# Altium project NUCLEOG431RB-Custom-IN-A2212.PrjPcb (part 4 of 4)

## Sheet Connector.SchDoc
size A3
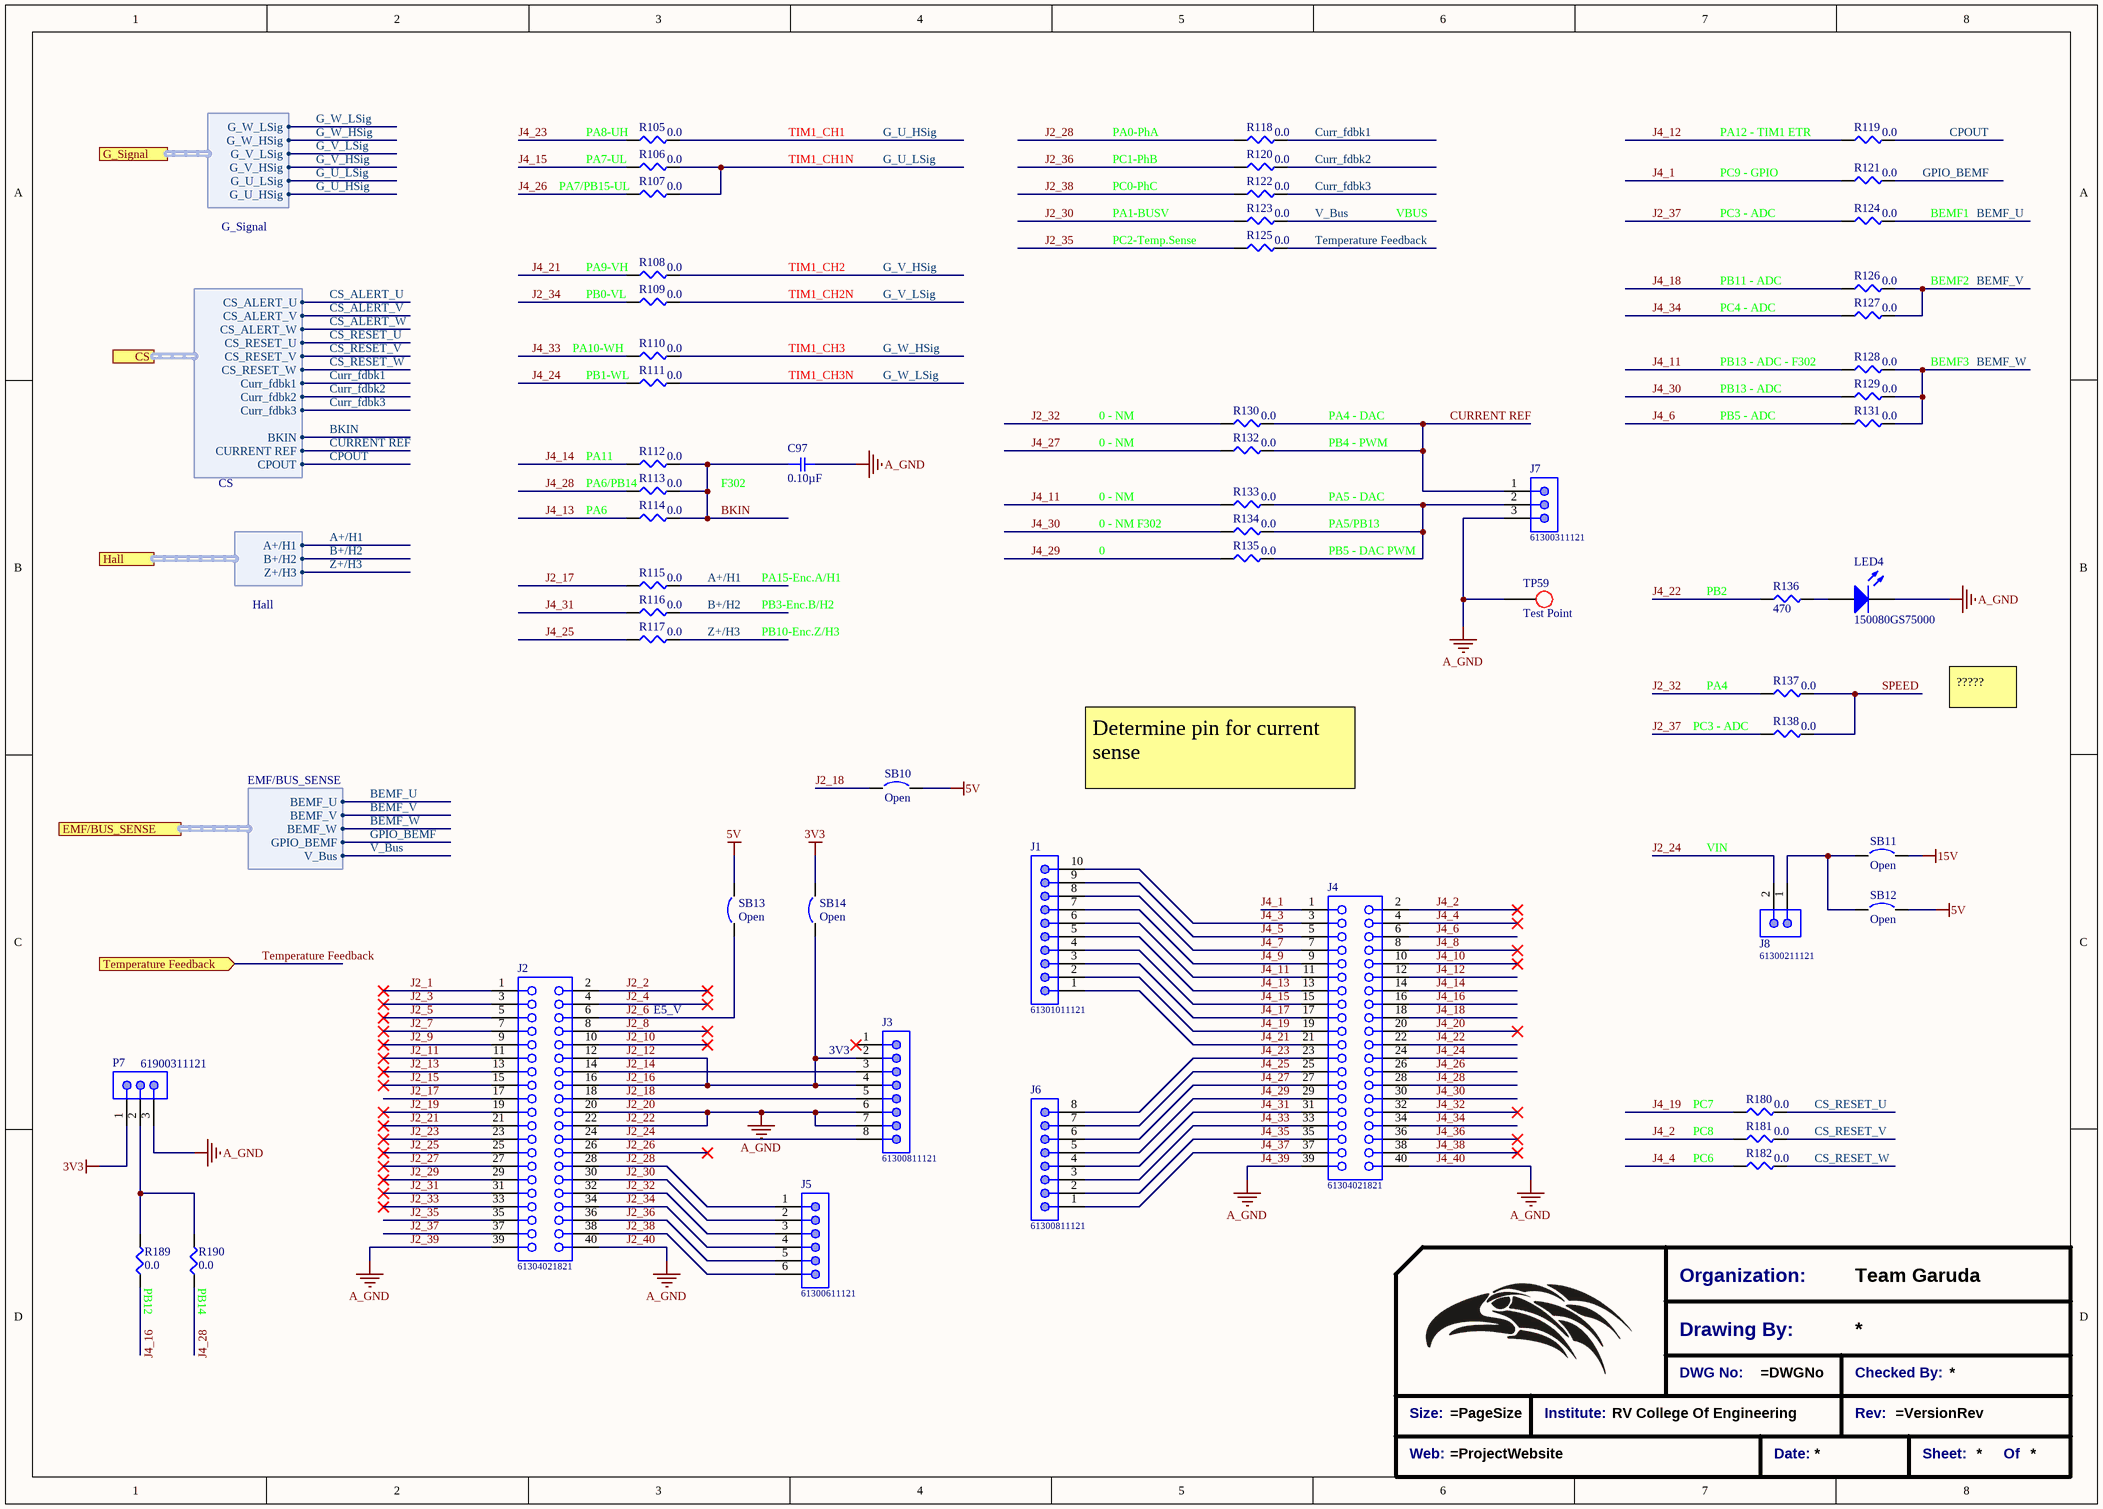
[diagram p9: Connector.SchDoc]

### Parts
(Parts that share a designator on the sheet are numbered #1, #2 ... from top to bottom, then left to right.)
*?#7  Title_Block  (value not drawn)  (graphical)
C97  0.10µF  [SMD-0805C]
J1  61301011121  [61301011121]
J2  61304021821  [61304021821]
J3  61300811121  [61300811121]
J4  61304021821  [61304021821]
J5  61300611121  [61300611121]
J6  61300811121  [61300811121]
J7  61300311121  [61300311121]
J8  61300211121  [61300211121]
LED4  150080GS75000  [0805_A]
P7  61900311121  [61900311121]
R105  0.0  [SMD-0603-RES]
R106  0.0  [SMD-0603-RES]
R107  0.0  [SMD-0603-RES]
R108  0.0  [SMD-0603-RES]
R109  0.0  [SMD-0603-RES]
R110  0.0  [SMD-0603-RES]
R111  0.0  [SMD-0603-RES]
R112  0.0  [SMD-0603-RES]
R113  0.0  [SMD-0603-RES]
R114  0.0  [SMD-0603-RES]
R115  0.0  [SMD-0603-RES]
R116  0.0  [SMD-0603-RES]
R117  0.0  [SMD-0603-RES]
R118  0.0  [SMD-0603-RES]
R119  0.0  [SMD-0603-RES]
R120  0.0  [SMD-0603-RES]
R121  0.0  [SMD-0603-RES]
R122  0.0  [SMD-0603-RES]
R123  0.0  [SMD-0603-RES]
R124  0.0  [SMD-0603-RES]
R125  0.0  [SMD-0603-RES]
R126  0.0  [SMD-0603-RES]
R127  0.0  [SMD-0603-RES]
R128  0.0  [SMD-0603-RES]
R129  0.0  [SMD-0603-RES]
R130  0.0  [SMD-0603-RES]
R131  0.0  [SMD-0603-RES]
R132  0.0  [SMD-0603-RES]
R133  0.0  [SMD-0603-RES]
R134  0.0  [SMD-0603-RES]
R135  0.0  [SMD-0603-RES]
R136  470  [SMD-0603-RES]
R137  0.0  [SMD-0603-RES]
R138  0.0  [SMD-0603-RES]
R180  0.0  [SMD-0603-RES]
R181  0.0  [SMD-0603-RES]
R182  0.0  [SMD-0603-RES]
R189  0.0  [SMD-0603-RES]
R190  0.0  [SMD-0603-RES]
SB10  Open  [Solder Bridge - HP]  (no BOM)
SB11  Open  [Solder Bridge - HP]  (no BOM)
SB12  Open  [Solder Bridge - HP]  (no BOM)
SB13  Open  [Solder Bridge - HP]  (no BOM)
SB14  Open  [0805-Solder Bridge]  (no BOM)
TP59  Test Point  [Test_point_THT]  (no BOM)

### Ports
CS (harness CS), EMF/BUS_SENSE (harness EMF/BUS_SENSE), G_Signal (harness G_Signal), Hall (harness Hall), Temperature Feedback (in)

### Harnesses
G_Signal: G_U_HSig, G_U_LSig, G_V_HSig, G_V_LSig, G_W_HSig, G_W_LSig
CS: CS_ALERT_U, CS_ALERT_V, CS_ALERT_W, CS_RESET_U, CS_RESET_V, CS_RESET_W, Curr_fdbk1, Curr_fdbk2, Curr_fdbk3, BKIN, CURRENT REF, CPOUT
Hall: A+/H1, B+/H2, Z+/H3
EMF/BUS_SENSE: BEMF_U, BEMF_V, BEMF_W, GPIO_BEMF, V_Bus

### Nets
3v3: P7.1 SB14.2
5V: SB10.2 SB12.2 SB13.2
15V: SB11.2
A_GND: C97.2 J2.20 J2.22 J2.39 J2.40 J3.6 J3.7 J4.39 J4.40 J7.3 LED4.1(K) P7.3 TP59.1  [also labelled J2_20, J2_22, J2_39, J2_40, J4_39, J4_40]
A+/H1: R115.2 ; port Hall.A+/H1
B+/H2: R116.2 ; port Hall.B+/H2
BEMF_U: R124.2 ; port EMF/BUS_SENSE.BEMF_U
BEMF_V: R126.2 R127.2 ; port EMF/BUS_SENSE.BEMF_V
BEMF_W: R128.2 R129.2 R131.2 ; port EMF/BUS_SENSE.BEMF_W
BKIN: C97.1 R112.2 R113.2 R114.2 ; port CS.BKIN
CPOUT: R119.2 ; port CS.CPOUT
CS_RESET_U: R180.2 ; port CS.CS_RESET_U
CS_RESET_V: R181.2 ; port CS.CS_RESET_V
CS_RESET_W: R182.2 ; port CS.CS_RESET_W
Curr_fdbk1: R118.2 ; port CS.Curr_fdbk1
Curr_fdbk2: R120.2 ; port CS.Curr_fdbk2
Curr_fdbk3: R122.2 ; port CS.Curr_fdbk3
CURRENT REF: J7.1 R130.2 R132.2 ; port CS.CURRENT REF
G_U_HSig: R105.2 ; port G_Signal.G_U_HSig
G_U_LSig: R106.2 R107.2 ; port G_Signal.G_U_LSig
G_V_HSig: R108.2 ; port G_Signal.G_V_HSig
G_V_LSig: R109.2 ; port G_Signal.G_V_LSig
G_W_HSig: R110.2 ; port G_Signal.G_W_HSig
G_W_LSig: R111.2 ; port G_Signal.G_W_LSig
GPIO_BEMF: R121.2 ; port EMF/BUS_SENSE.GPIO_BEMF
J2_1: J2.1
J2_2: J2.2
J2_3: J2.3
J2_4: J2.4
J2_5: J2.5
J2_6: J2.6 SB13.1
J2_7: J2.7
J2_8: J2.8
J2_9: J2.9
J2_10: J2.10
J2_11: J2.11
J2_12: J2.12 J2.16 J3.2 J3.4 SB14.1  [also labelled J2_16]
J2_13: J2.13
J2_14: J2.14 J3.3
J2_15: J2.15
J2_17: J2.17 R115.1
J2_18: J2.18 J3.5 SB10.1
J2_19: J2.19
J2_21: J2.21
J2_23: J2.23
J2_24: J2.24 J3.8 J8.2
J2_25: J2.25
J2_26: J2.26
J2_27: J2.27
J2_28: J2.28 J5.1 R118.1
J2_29: J2.29
J2_30: J2.30 J5.2 R123.1
J2_31: J2.31
J2_32: J2.32 J5.3 R130.1 R137.1
J2_33: J2.33
J2_34: J2.34 J5.4 R109.1
J2_35: J2.35 R125.1
J2_36: J2.36 J5.5 R120.1
J2_37: J2.37 R124.1 R138.1
J2_38: J2.38 J5.6 R122.1
J4_1: J4.1 R121.1
J4_2: J4.2 R181.1
J4_3: J1.10 J4.3
J4_4: J4.4 R182.1
J4_5: J1.9 J4.5
J4_6: J4.6 R131.1
J4_7: J1.8 J4.7
J4_8: J4.8
J4_9: J1.7 J4.9
J4_10: J4.10
J4_11: J1.6 J4.11 R128.1 R133.1
J4_12: J4.12 R119.1
J4_13: J1.5 J4.13 R114.1
J4_14: J4.14 R112.1
J4_15: J1.4 J4.15 R106.1
J4_16: J4.16 R189.1
J4_17: J1.3 J4.17
J4_18: J4.18 R126.1
J4_19: J1.2 J4.19 R180.1
J4_20: J4.20
J4_21: J1.1 J4.21 R108.1
J4_22: J4.22 R136.1
J4_23: J4.23 J6.8 R105.1
J4_24: J4.24 R111.1
J4_25: J4.25 J6.7 R117.1
J4_26: J4.26 R107.1
J4_27: J4.27 J6.6 R132.1
J4_28: J4.28 R113.1 R190.1
J4_29: J4.29 J6.5 R135.1
J4_30: J4.30 R129.1 R134.1
J4_31: J4.31 J6.4 R116.1
J4_32: J4.32
J4_33: J4.33 J6.3 R110.1
J4_34: J4.34 R127.1
J4_35: J4.35 J6.2
J4_36: J4.36
J4_37: J4.37 J6.1
J4_38: J4.38
SPEED: R137.2 R138.2
Temperature Feedback: R125.2 ; port Temperature Feedback
V_Bus: R123.2 ; port EMF/BUS_SENSE.V_Bus
Z+/H3: R117.2 ; port Hall.Z+/H3
NetJ7_2: J7.2 R133.2 R134.2 R135.2
NetJ8_1: J8.1 SB11.1 SB12.1
NetLED4_2: LED4.2(A) R136.2
NetP7_2: P7.2 R189.2 R190.2

Not connected (* = marked no-connect by the designer): J3 1*

### Notes on the sheet
- (near R105) PA8-UH
- PA7-UL
- TIM1_CH1
- TIM1_CH1N
- PA0-PhA
- PC1-PhB
- PA12 - TIM1 ETR
- PC9 - GPIO
- PA7/PB15-UL
- PC0-PhC
- PA1-BUSV
- PC2-Temp.Sense
- VBUS
- PC3 - ADC
- BEMF1
- (near R108) PA9-VH
- PB0-VL
- TIM1_CH2
- TIM1_CH2N
- PB11 - ADC
- PC4 - ADC
- BEMF2
- PA10-WH
- PB1-WL
- TIM1_CH3
- TIM1_CH3N
- PB13 - ADC - F302
- BEMF3
- 0 - NM
- PA4 - DAC
- PB4 - PWM
- PB13 - ADC
- PB5 - ADC
- PA11
- (near R113) PA6/PB14
- PA6
- F302
- PA5 - DAC
- PA15-Enc.A/H1
- 0 - NM F302
- 0
- PA5/PB13
- PB5 - DAC PWM
- PB3-Enc.B/H2
- PB10-Enc.Z/H3
- (near R136) PB2
- PA4
- ?????
- Determine pin for current sense
- VIN
- E5_V
- (near J3) 3V3
- PC7
- PC8
- PC6
- (near R189) PB12
- (near R190) PB14
- (in symbol Title_Block) Organization:; Team Garuda; Drawing By:; DWG No:; Checked By:; Size:; Institute:; RV College Of Engineering; Rev:; Web:; Date:; Sheet:; Of

### Library data of the parts
*?#7 = Title_Block: Standard Title Block
C97 = GCD21BR71H104KA01L: CAP CER 0.1UF 50V X7R 0805; Manufacturer: Murata Electronics North America; Factory Stock: 0; Unit Price (USD): 0.24; Minimum Quantity: 1; Tolerance: ±10%; Datasheets: http://www.murata.com/~/media/webrenewal/support/library/catalog/products/capacitor/mlcc/c03e.ashx; Image: //media.digikey.com/Renders/Murata%20Renders/0805%28GxM6%29.jpg; Digi-Key Part Number: 490-11955-1-ND; Part Number: GCD21BR71H104KA01L; Quantity Available: 157; @ qty: 0; Packaging: Cut Tape (CT); Series: GCD; Part Status: Active; Value: 0.10µF; Voltage: 50V; Temperature Coefficient: X7R; Operating Temperature: -55°C ~ 125°C; Features: -; Ratings: AEC-Q200; Applications: Automotive; Mounting Type: Surface Mount, MLCC; Package / Case: 0805 (2012 Metric); Size / Dimension: 0.079" L x 0.049" W (2.00mm x 1.25mm); Height - Seated (Max): -; Thickness (Max): 0.049" (1.25mm); Lead Spacing: -; Lead Style: -
J1 = 61301011121: WR-PHD Pin Header, THT, pitch 2.54mm, Single Row, Vertical, 10pin; Pin Number: 10; Gender: Male; Rated Current: 3A; Working Voltage: 250VAC; Withstanding Voltage: 500VAC; Contact Resistance: 20mOhm; ComponentLink1Description: Manufacturer; ComponentLink1URL: http://www.we-online.de; ComponentLink2Description: Datasheet; ComponentLink2URL: https://katalog.we-online.de/em/datasheet/6130xx11121.pdf; Part Number: 61301011121; Published Date: June 2019; Publisher: Wurth Elektronik; Pitch: 2.54mm; Operating Temperature: -40 to +105degC; Mounting Technology: THT; Packaging: Bag; Row Number: Single; Orientation: Vertical
J2 J4 = 61304021821: WR-PHD Socket Header, THT, pitch 2.54mm, Dual Row, Vertical, 40pin; Pin Number: 40; Gender: Female; Rated Current: 3A; Working Voltage: 250VAC; Withstanding Voltage: 500VAC; Contact Resistance: 20mOhm; ComponentLink1Description: Manufacturer; ComponentLink1URL: http://www.we-online.de; ComponentLink2Description: Datasheet; ComponentLink2URL: https://katalog.we-online.de/em/datasheet/6130xx21821.pdf; Part Number: 61304021821; Published Date: June 2019; Publisher: Wurth Elektronik; Pitch: 2.54mm; Operating Temperature: -40 to +125degC; Mounting Technology: THT; Packaging: Tray; Row Number: Dual; Orientation: Vertical
J3 J6 = 61300811121: WR-PHD Pin Header, THT, pitch 2.54mm, Single Row, Vertical, 8pin; Pin Number: 8; Gender: Male; Rated Current: 3A; Working Voltage: 250VAC; Withstanding Voltage: 500VAC; Contact Resistance: 20mOhm; ComponentLink1Description: Manufacturer; ComponentLink1URL: http://www.we-online.de; ComponentLink2Description: Datasheet; ComponentLink2URL: https://katalog.we-online.de/em/datasheet/6130xx11121.pdf; Part Number: 61300811121; Published Date: June 2019; Publisher: Wurth Elektronik; Pitch: 2.54mm; Operating Temperature: -40 to +105degC; Mounting Technology: THT; Packaging: Bag; Row Number: Single; Orientation: Vertical
J5 = 61300611121: WR-PHD Pin Header, THT, pitch 2.54mm, Single Row, Vertical, 6pin; Pin Number: 6; Gender: Male; Rated Current: 3A; Working Voltage: 250VAC; Withstanding Voltage: 500VAC; Contact Resistance: 20mOhm; ComponentLink1Description: Manufacturer; ComponentLink1URL: http://www.we-online.de; ComponentLink2Description: Datasheet; ComponentLink2URL: https://katalog.we-online.de/em/datasheet/6130xx11121.pdf; Part Number: 61300611121; Published Date: June 2019; Publisher: Wurth Elektronik; Pitch: 2.54mm; Operating Temperature: -40 to +105degC; Mounting Technology: THT; Packaging: Bag; Row Number: Single; Orientation: Vertical
J7 = 61300311121: WR-PHD Pin Header, THT, pitch 2.54mm, Single Row, Vertical, 3pin; Pin Number: 3; Gender: Male; Rated Current: 3A; Working Voltage: 250VAC; Withstanding Voltage: 500VAC; Contact Resistance: 20mOhm; ComponentLink1Description: Manufacturer; ComponentLink1URL: http://www.we-online.de; ComponentLink2Description: Datasheet; ComponentLink2URL: https://katalog.we-online.de/em/datasheet/6130xx11121.pdf; Part Number: 61300311121; Published Date: June 2019; Publisher: Wurth Elektronik; Pitch: 2.54mm; Operating Temperature: -40 to +105degC; Mounting Technology: THT; Packaging: Bag; Row Number: Single; Orientation: Vertical
J8 = 61300211121: WR-PHD Pin Header, THT, pitch 2.54mm, Single Row, Vertical, 2pin; Pin Number: 2; Gender: Male; Rated Current: 3A; Working Voltage: 250VAC; Withstanding Voltage: 500VAC; Contact Resistance: 20mOhm; ComponentLink1Description: Manufacturer; ComponentLink1URL: http://www.we-online.de; ComponentLink2Description: Datasheet; ComponentLink2URL: https://katalog.we-online.de/em/datasheet/6130xx11121.pdf; Part Number: 61300211121; Published Date: June 2019; Publisher: Wurth Elektronik; Pitch: 2.54mm; Operating Temperature: -40 to +105degC; Mounting Technology: THT; Packaging: Bag; Row Number: Single; Orientation: Vertical
LED4 = 150080GS75000: SMD mono-color Chip LED, WL-SMCW, Green; PackageReference: 0805_A; Color: Green; PartNumber: 150080GS75000; ComponentLink1Description: Manufacturer URL; ComponentLink1URL: http://www.we-online.com; ComponentLink2Description: Datasheet; ComponentLink2URL: http://katalog.we-online.com/led/datasheet/150080GS75000.pdf
P7 = 61900311121: WR-WTB THT Male Vertical Locking Header, pitch 2.54mm, 3p; Pin Number: 3; Contact Resistance: 20mOhm; Rated Current: 3A; Withstanding Voltage: 1000VAC; Working Voltage: 250VAC; ComponentLink1Description: Manufacturer; ComponentLink1URL: http://www.we-online.de; ComponentLink2Description: Datasheet; ComponentLink2URL: https://www.we-online.com/catalog/datasheet/61900311121.pdf; Pitch: 2.54mm; Published Date: January 2020; Publisher: Wurth Elektronik; Mounting Technology: THT; Packaging: Bag; Operating Temperature: -40 to +105degC; Part Number: 61900311121; Gender: Male; Type: Vertical
R105-R135 R137 R138 R180-R182 R189 R190 = ERJ-3GEY0R00V: RES SMD 0.0OHM JUMPER 1/10W 0603; Manufacturer: Panasonic Electronic Components; Factory Stock: 0; Unit Price (USD): 0.00352; @ qty: 1500; Minimum Quantity: 1; Power (Watts): 0.1W, 1/10W; Part Number: ERJ-3GEY0R00V; Datasheets: http://industrial.panasonic.com/www-cgi/jvcr13pz.cgi?E+PZ+3+AOA0001+ERJ3GEY0R00V+7+WW; Image: //media.digikey.com/Photos/Panasonic%20Photos/MFG_ERJ-P6W%20Series.jpg; Digi-Key Part Number: P0.0GCT-ND; Quantity Available: 4813372; Packaging: Cut Tape (CT); Series: ERJ; Part Status: Active; Value: 0.0; Tolerance: Jumper; Composition: Thick Film; Features: Automotive AEC-Q200; Temperature Coefficient: -; Operating Temperature: -55°C ~ 155°C; Package / Case: 0603 (1608 Metric); Supplier Device Package: 0603; Size / Dimension: 0.063" L x 0.031" W (1.60mm x 0.80mm); Height - Seated (Max): 0.022" (0.55mm); Number of Terminations: 2; Failure Rate: -
R136 = ERJ-3EKF4700V: RES SMD 470 OHM 1% 1/10W 0603; Manufacturer: Panasonic Electronic Components; Factory Stock: 0; Unit Price (USD): 0.00379; @ qty: 1500; Minimum Quantity: 1; Power (Watts): 0.1W, 1/10W; Temperature Coefficient: ±100ppm/°C; Part Number: ERJ-3EKF4700V; Datasheets: http://industrial.panasonic.com/www-cgi/jvcr13pz.cgi?E+PZ+3+AOA0002+ERJ3EKF4700V+7+WW; Image: //media.digikey.com/Photos/Panasonic%20Photos/MFG_ERJ-P6W%20Series.jpg; Digi-Key Part Number: P470HCT-ND; Quantity Available: 553629; Packaging: Cut Tape (CT); Series: ERJ; Part Status: Active; Value: 470; Tolerance: ±1%; Composition: Thick Film; Features: Automotive AEC-Q200; Operating Temperature: -55°C ~ 155°C; Package / Case: 0603 (1608 Metric); Supplier Device Package: 0603; Size / Dimension: 0.063" L x 0.031" W (1.60mm x 0.80mm); Height - Seated (Max): 0.022" (0.55mm); Number of Terminations: 2; Failure Rate: -
SB10-SB14 = Solder Bridge: Circuit Breaker; Published: 24-Mar-1999; Revision: July-2002: Re-released for DXP Platform.; Publisher: Altium Limited

## Sheet Hall_Input.SchDoc
size A4
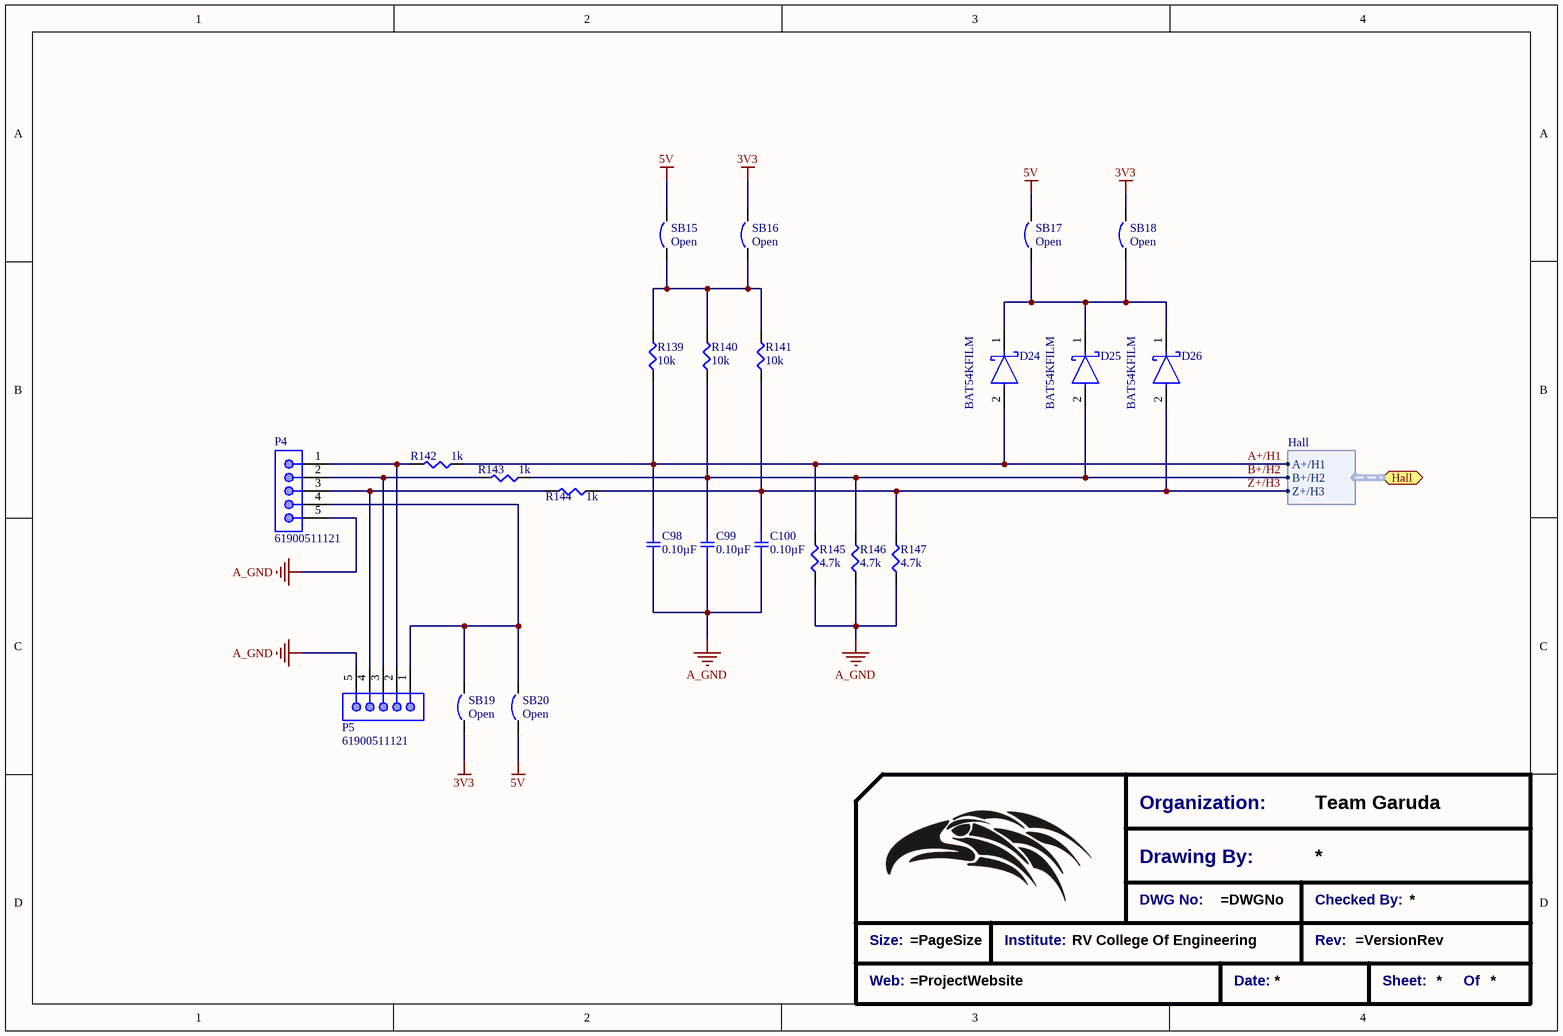
[diagram p10: Hall_Input.SchDoc]

### Parts
(Parts that share a designator on the sheet are numbered #1, #2 ... from top to bottom, then left to right.)
*?#8  Title_Block  (value not drawn)  (graphical)
C98  0.10µF  [SMD-0805C]
C99  0.10µF  [SMD-0805C]
C100  0.10µF  [SMD-0805C]
D24  BAT54KFILM  [FP-SOD-523-MFG]
D25  BAT54KFILM  [FP-SOD-523-MFG]
D26  BAT54KFILM  [FP-SOD-523-MFG]
P4  61900511121  [61900511121]
P5  61900511121  [61900511121]
R139  10k  [SMD-0603-RES]
R140  10k  [SMD-0603-RES]
R141  10k  [SMD-0603-RES]
R142  1k  [SMD-0603-RES]
R143  1k  [SMD-0603-RES]
R144  1k  [SMD-0603-RES]
R145  4.7k  [SMD-0603-RES]
R146  4.7k  [SMD-0603-RES]
R147  4.7k  [SMD-0603-RES]
SB15  Open  [Solder Bridge - HP - SQ]  (no BOM)
SB16  Open  [Solder Bridge - HP - SQ]  (no BOM)
SB17  Open  [Solder Bridge - HP - SQ]  (no BOM)
SB18  Open  [Solder Bridge - HP - SQ]  (no BOM)
SB19  Open  [Solder Bridge - HP - SQ]  (no BOM)
SB20  Open  [Solder Bridge - HP - SQ]  (no BOM)

### Ports
Hall (bidir, harness Hall)

### Harnesses
Hall: A+/H1, B+/H2, Z+/H3

### Nets
3v3: SB16.2 SB18.2 SB19.1
5V: SB15.2 SB17.2 SB20.1
A_GND: C98.1 C99.1 C100.1 P4.5 P5.5 R145.1 R146.1 R147.1
A+/H1: C98.2 D24.2(A) R139.1 R142.1 R145.2 ; port Hall.A+/H1
B+/H2: C99.2 D25.2(A) R140.1 R143.1 R146.2 ; port Hall.B+/H2
Z+/H3: C100.2 D26.2(A) R141.1 R144.1 R147.2 ; port Hall.Z+/H3
NetD24_1: D24.1(C) D25.1(C) D26.1(C) SB17.1 SB18.1
NetP4_1: P4.1 P5.2 R142.2
NetP4_2: P4.2 P5.3 R143.2
NetP4_3: P4.3 P5.4 R144.2
NetP4_4: P4.4 P5.1 SB19.2 SB20.2
NetR139_2: R139.2 R140.2 R141.2 SB15.1 SB16.1

### Notes on the sheet
- (in symbol Title_Block) Organization:; Team Garuda; Drawing By:; DWG No:; Checked By:; Size:; Institute:; RV College Of Engineering; Rev:; Web:; Date:; Sheet:; Of

### Library data of the parts
*?#8 = Title_Block: Standard Title Block
C98-C100 = GCD21BR71H104KA01L: as C97 on sheet Connector; Datasheets: http://www.murata.com/~/media/webrenewal/support/library/catalog/products/capacitor/mlcc/c03e.ashx; Image: //media.digikey.com/Renders/Murata%20Renders/0805%28GxM6%29.jpg; Digi-Key Part Number: 490-11955-1-ND; Part Number: GCD21BR71H104KA01L; Quantity Available: 157; @ qty: 0; Packaging: Cut Tape (CT); Series: GCD; Part Status: Active; Value: 0.10µF; Voltage: 50V; Temperature Coefficient: X7R; Operating Temperature: -55°C ~ 125°C; Features: -; Ratings: AEC-Q200; Applications: Automotive; Mounting Type: Surface Mount, MLCC; Package / Case: 0805 (2012 Metric); Size / Dimension: 0.079" L x 0.049" W (2.00mm x 1.25mm); Height - Seated (Max): -; Thickness (Max): 0.049" (1.25mm); Lead Spacing: -; Lead Style: -
D24-D26 = CMP-12187-000026-1: DIODE SCHOTTKY 40V 300MA SOD523; Manufacturer: STMicroelectronics; Capacitance: 7pF; Value: 7pF; Max Surge Forward Current: 1.25A; Peak Reverse Current: 1uA; Max Junction Temp: +150°C; Device Class L2: Diodes; Temperature Range Low: -40°C; Category: Diode; Manufacturer Part Number: BAT54KFILM; Digikey Description: DIODE SCHOTTKY 40V 300MA SOD523; Device Class L3: Schottky Diodes; Automotive: No; Height: 0.7mm; Octopart: https://octopart.com/bat54kfilm-stmicroelectronics-39618022; ComponentLink2Description: Datasheet; Temperature Range High: +150°C; Device Class L1: Discrete Semiconductors; Max Repetitive Reverse Voltage: 40V; RoHS: TRUE; Temperature: -40°C to +150°C; ComponentLink2URL: https://www.st.com/content/ccc/resource/technical/document/datasheet/07/50/54/f2/0d/ba/4a/79/CD00001322.pdf/files/CD00001322.pdf/jcr:content/translations/en.CD00001322.pdf; Lead Free: Yes; Forward Current: 300mA; Package: SOD-523; Mouser Description: Schottky Diodes & Rectifiers schottky diode
P4 P5 = 61900511121: WR-WTB THT Male Vertical Locking Header, pitch 2.54mm, 5p; Pin Number: 5; Contact Resistance: 20mOhm; Rated Current: 3A; Withstanding Voltage: 1000VAC; Working Voltage: 250VAC; ComponentLink1Description: Manufacturer; ComponentLink1URL: http://www.we-online.de; ComponentLink2Description: Datasheet; ComponentLink2URL: https://www.we-online.com/catalog/datasheet/61900511121.pdf; Pitch: 2.54mm; Published Date: January 2020; Publisher: Wurth Elektronik; Mounting Technology: THT; Packaging: Bag; Operating Temperature: -40 to +105degC; Part Number: 61900511121; Gender: Male; Type: Vertical
R139-R141 = ERJ-3EKF1002V: RES SMD 10K OHM 1% 1/10W 0603; Manufacturer: Panasonic Electronic Components; Factory Stock: 0; Unit Price (USD): 0.00379; @ qty: 1500; Minimum Quantity: 1; Power (Watts): 0.1W, 1/10W; Temperature Coefficient: ±100ppm/°C; Part Number: ERJ-3EKF1002V; Datasheets: http://industrial.panasonic.com/www-cgi/jvcr13pz.cgi?E+PZ+3+AOA0002+ERJ3EKF1002V+7+WW; Image: //media.digikey.com/Photos/Panasonic%20Photos/MFG_ERJ-P6W%20Series.jpg; Digi-Key Part Number: P10.0KHCT-ND; Quantity Available: 6703141; Packaging: Cut Tape (CT); Series: ERJ; Part Status: Active; Value: 10k; Tolerance: ±1%; Composition: Thick Film; Features: Automotive AEC-Q200; Operating Temperature: -55°C ~ 155°C; Package / Case: 0603 (1608 Metric); Supplier Device Package: 0603; Size / Dimension: 0.063" L x 0.031" W (1.60mm x 0.80mm); Height - Seated (Max): 0.022" (0.55mm); Number of Terminations: 2; Failure Rate: -
R142-R144 = ERJ-3EKF1001V: RES SMD 1K OHM 1% 1/10W 0603; Manufacturer: Panasonic Electronic Components; Factory Stock: 0; Unit Price (USD): 0.00379; @ qty: 1500; Minimum Quantity: 1; Power (Watts): 0.1W, 1/10W; Temperature Coefficient: ±100ppm/°C; Part Number: ERJ-3EKF1001V; Datasheets: http://industrial.panasonic.com/www-cgi/jvcr13pz.cgi?E+PZ+3+AOA0002+ERJ3EKF1001V+7+WW; Image: //media.digikey.com/Photos/Panasonic%20Photos/MFG_ERJ-P6W%20Series.jpg; Digi-Key Part Number: P1.00KHCT-ND; Quantity Available: 5218845; Packaging: Cut Tape (CT); Series: ERJ; Part Status: Active; Value: 1k; Tolerance: ±1%; Composition: Thick Film; Features: Automotive AEC-Q200; Operating Temperature: -55°C ~ 155°C; Package / Case: 0603 (1608 Metric); Supplier Device Package: 0603; Size / Dimension: 0.063" L x 0.031" W (1.60mm x 0.80mm); Height - Seated (Max): 0.022" (0.55mm); Number of Terminations: 2; Failure Rate: -
R145-R147 = ERJ-3GEYJ472V: RES SMD 4.7K OHM 5% 1/10W 0603; Manufacturer: Panasonic Electronic Components; Factory Stock: 0; Unit Price (USD): 0.00321; @ qty: 1500; Minimum Quantity: 1; Power (Watts): 0.1W, 1/10W; Temperature Coefficient: ±200ppm/°C; Part Number: ERJ-3GEYJ472V; Datasheets: http://industrial.panasonic.com/www-cgi/jvcr13pz.cgi?E+PZ+3+AOA0001+ERJ3GEYJ472V+7+WW; Image: //media.digikey.com/Photos/Panasonic%20Photos/MFG_ERJ-P6W%20Series.jpg; Digi-Key Part Number: P4.7KGCT-ND; Quantity Available: 683531; Packaging: Cut Tape (CT); Series: ERJ; Part Status: Active; Value: 4.7k; Tolerance: ±5%; Composition: Thick Film; Features: Automotive AEC-Q200; Operating Temperature: -55°C ~ 155°C; Package / Case: 0603 (1608 Metric); Supplier Device Package: 0603; Size / Dimension: 0.063" L x 0.031" W (1.60mm x 0.80mm); Height - Seated (Max): 0.022" (0.55mm); Number of Terminations: 2; Failure Rate: -
SB15-SB20 = Solder Bridge: Circuit Breaker; Published: 24-Mar-1999; Revision: July-2002: Re-released for DXP Platform.; Publisher: Altium Limited

## Sheet Thermal_Sense.SchDoc
size A4
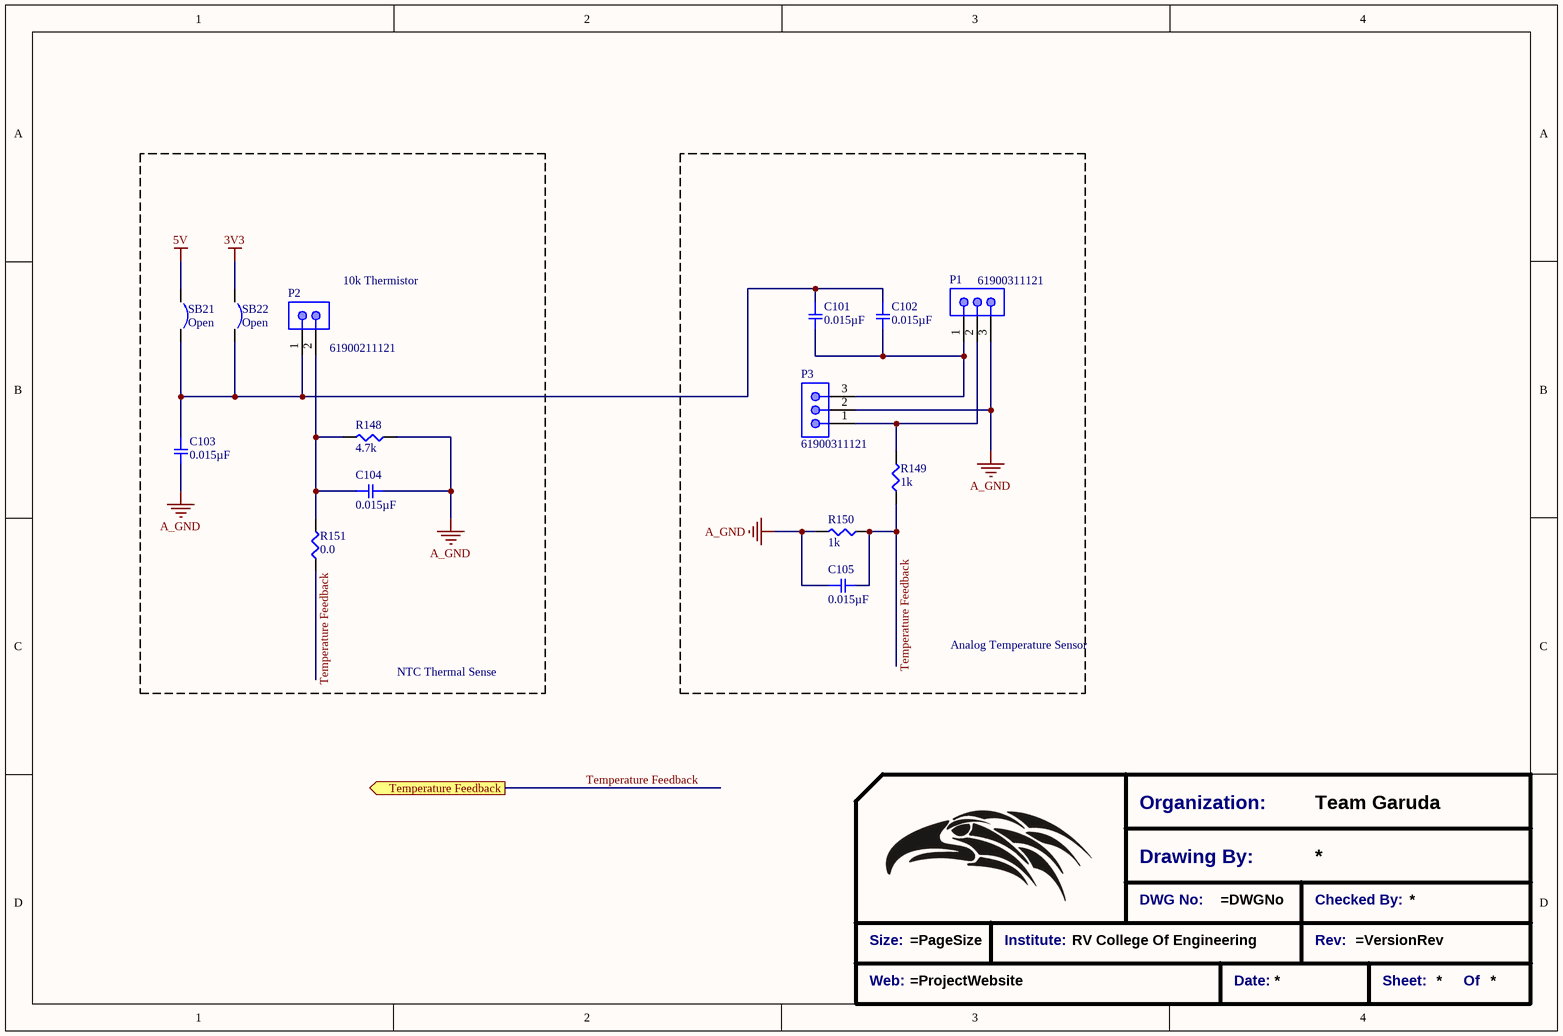
[diagram p11: Thermal_Sense.SchDoc]

### Parts
(Parts that share a designator on the sheet are numbered #1, #2 ... from top to bottom, then left to right.)
*?#9  Title_Block  (value not drawn)  (graphical)
C101  0.015µF  [SMD-0805C]
C102  0.015µF  [SMD-0805C]
C103  0.015µF  [SMD-0805C]
C104  0.015µF  [SMD-0805C]
C105  0.015µF  [SMD-0805C]
P1  61900311121  [61900311121]
P2  61900211121  [61900211121]
P3  61900311121  [61900311121]
R148  4.7k  [SMD-0603-RES]
R149  1k  [SMD-0603-RES]
R150  1k  [SMD-0603-RES]
R151  0.0  [SMD-0603-RES]
SB21  Open  [Solder Bridge - HP - SQ]  (no BOM)
SB22  Open  [Solder Bridge - HP - SQ]  (no BOM)

### Blocks framed on the sheet
Analog Temperature Sensor: C101 C102 C105 P1 P3 R149 R150

### Ports
Temperature Feedback (out)

### Nets
3v3: SB22.1
5V: SB21.1
A_GND: C103.2 C104.2 C105.1 P1.3 P3.2 R148.1 R150.2
Temperature Feedback: C105.2 R149.1 R150.1 R151.1 ; port Temperature Feedback
NetC101_1: C101.1 C102.1 C103.1 P2.1 SB21.2 SB22.2
NetC101_2: C101.2 C102.2 P1.1 P3.3
NetC104_1: C104.1 P2.2 R148.2 R151.2
NetP1_2: P1.2 P3.1 R149.2

### Notes on the sheet
- (near P2) 10k Thermistor
- NTC Thermal Sense
- (in symbol Title_Block) Organization:; Team Garuda; Drawing By:; DWG No:; Checked By:; Size:; Institute:; RV College Of Engineering; Rev:; Web:; Date:; Sheet:; Of

### Library data of the parts
*?#9 = Title_Block: Standard Title Block
C101-C105 = GC321AD72E153KX01D: CAP CER 0.015UF 250V X7T 0805; Manufacturer: Murata Electronics North America; Factory Stock: 0; Unit Price (USD): 0.27; Minimum Quantity: 1; Tolerance: ±10%; Datasheets: http://search.murata.co.jp/Ceramy/image/img/A01X/G101/ENG/GC321AD72E153KX01-01.pdf; Image: //media.digikey.com/Renders/Murata%20Renders/0805(GC3)200x125.jpg; Digi-Key Part Number: 490-13987-1-ND; Part Number: GC321AD72E153KX01D; Quantity Available: 4000; @ qty: 0; Packaging: Cut Tape (CT); Series: GC3; Part Status: Active; Value: 0.015µF; Voltage: 250V; Temperature Coefficient: X7T; Operating Temperature: -55°C ~ 125°C; Features: -; Ratings: AEC-Q200; Applications: Automotive; Mounting Type: Surface Mount, MLCC; Package / Case: 0805 (2012 Metric); Size / Dimension: 0.079" L x 0.049" W (2.00mm x 1.25mm); Height - Seated (Max): -; Thickness (Max): 0.039" (1.00mm); Lead Spacing: -; Lead Style: -
P1 P3 = 61900311121: as P7 on sheet Connector; ComponentLink1Description: Manufacturer; ComponentLink1URL: http://www.we-online.de; ComponentLink2Description: Datasheet; ComponentLink2URL: https://www.we-online.com/catalog/datasheet/61900311121.pdf; Pitch: 2.54mm; Published Date: January 2020; Publisher: Wurth Elektronik; Mounting Technology: THT; Packaging: Bag; Operating Temperature: -40 to +105degC; Part Number: 61900311121; Gender: Male; Type: Vertical
P2 = 61900211121: WR-WTB THT Male Vertical Locking Header, pitch 2.54mm, 2p; Pin Number: 2; Contact Resistance: 20mOhm; Rated Current: 3A; Withstanding Voltage: 1000VAC; Working Voltage: 250VAC; ComponentLink1Description: Manufacturer; ComponentLink1URL: http://www.we-online.de; ComponentLink2Description: Datasheet; ComponentLink2URL: https://www.we-online.com/catalog/datasheet/61900211121.pdf; Pitch: 2.54mm; Published Date: January 2020; Publisher: Wurth Elektronik; Mounting Technology: THT; Packaging: Bag; Operating Temperature: -40 to +105degC; Part Number: 61900211121; Gender: Male; Type: Vertical
R148 = ERJ-3EKF4701V: RES SMD 4.7K OHM 1% 1/10W 0603; Manufacturer: Panasonic Electronic Components; Factory Stock: 0; Unit Price (USD): 0.00379; @ qty: 1500; Minimum Quantity: 1; Power (Watts): 0.1W, 1/10W; Temperature Coefficient: ±100ppm/°C; Part Number: ERJ-3EKF4701V; Datasheets: http://industrial.panasonic.com/www-cgi/jvcr13pz.cgi?E+PZ+3+AOA0002+ERJ3EKF4701V+7+WW; Image: //media.digikey.com/Photos/Panasonic%20Photos/MFG_ERJ-P6W%20Series.jpg; Digi-Key Part Number: P4.70KHCT-ND; Quantity Available: 999380; Packaging: Cut Tape (CT); Series: ERJ; Part Status: Active; Value: 4.7k; Tolerance: ±1%; Composition: Thick Film; Features: Automotive AEC-Q200; Operating Temperature: -55°C ~ 155°C; Package / Case: 0603 (1608 Metric); Supplier Device Package: 0603; Size / Dimension: 0.063" L x 0.031" W (1.60mm x 0.80mm); Height - Seated (Max): 0.022" (0.55mm); Number of Terminations: 2; Failure Rate: -
R149 R150 = ERJ-3EKF1001V: as R142 on sheet Hall_Input; Part Number: ERJ-3EKF1001V; Datasheets: http://industrial.panasonic.com/www-cgi/jvcr13pz.cgi?E+PZ+3+AOA0002+ERJ3EKF1001V+7+WW; Image: //media.digikey.com/Photos/Panasonic%20Photos/MFG_ERJ-P6W%20Series.jpg; Digi-Key Part Number: P1.00KHCT-ND; Quantity Available: 5218845; Packaging: Cut Tape (CT); Series: ERJ; Part Status: Active; Value: 1k; Tolerance: ±1%; Composition: Thick Film; Features: Automotive AEC-Q200; Operating Temperature: -55°C ~ 155°C; Package / Case: 0603 (1608 Metric); Supplier Device Package: 0603; Size / Dimension: 0.063" L x 0.031" W (1.60mm x 0.80mm); Height - Seated (Max): 0.022" (0.55mm); Number of Terminations: 2; Failure Rate: -
R151 = ERJ-3GEY0R00V: as R105 on sheet Connector; Part Number: ERJ-3GEY0R00V; Datasheets: http://industrial.panasonic.com/www-cgi/jvcr13pz.cgi?E+PZ+3+AOA0001+ERJ3GEY0R00V+7+WW; Image: //media.digikey.com/Photos/Panasonic%20Photos/MFG_ERJ-P6W%20Series.jpg; Digi-Key Part Number: P0.0GCT-ND; Quantity Available: 4813372; Packaging: Cut Tape (CT); Series: ERJ; Part Status: Active; Value: 0.0; Tolerance: Jumper; Composition: Thick Film; Features: Automotive AEC-Q200; Temperature Coefficient: -; Operating Temperature: -55°C ~ 155°C; Package / Case: 0603 (1608 Metric); Supplier Device Package: 0603; Size / Dimension: 0.063" L x 0.031" W (1.60mm x 0.80mm); Height - Seated (Max): 0.022" (0.55mm); Number of Terminations: 2; Failure Rate: -
SB21 SB22 = Solder Bridge: Circuit Breaker; Published: 24-Mar-1999; Revision: July-2002: Re-released for DXP Platform.; Publisher: Altium Limited

## Nets that join several sheets
3v3: Auxillary_Supply (6 pins), Power_Section (D13.1), Analog_Sense (7 pins), Connector (P7.1 SB14.2), Hall_Input (SB16.2 SB18.2 SB19.1), Thermal_Sense (SB22.1)
5V: Auxillary_Supply (C122.2 C123.1 P6.1 U10.3), Isolated_Bias (9 pins), Analog_Sense (SB24.2 SB26.2), Connector (SB10.2 SB12.2 SB13.2), Hall_Input (SB15.2 SB17.2 SB20.1), Thermal_Sense (SB21.1)
15V: Auxillary_Supply (13 pins), Isolated_Bias (5 pins), Gate_Driver (30 pins), Connector (SB11.2)
60V: Auxillary_Supply (6 pins), Power_Section (17 pins)
A_GND: Auxillary_Supply (33 pins), Isolated_Bias (13 pins), Power_Section (15 pins), Gate_Driver (36 pins), Analog_Sense (14 pins), Current Sense (33 pins), Connector (13 pins), Hall_Input (8 pins), Thermal_Sense (7 pins)
CMP_Supply: Analog_Sense (C120.1 C121.1 SB25.1 SB26.1), Current Sense (6 pins)
GND_ISO_U: Isolated_Bias (6 pins), Gate_Driver (R164.2)
GND_ISO_V: Isolated_Bias (5 pins), Gate_Driver (R172.2)
GND_ISO_W: Isolated_Bias (5 pins), Gate_Driver (R174.2)
OPAMP_Supply: Analog_Sense (6 pins), Current Sense (24 pins)
VCC_HB_U: Isolated_Bias (6 pins), Gate_Driver (R54.2)
VCC_HB_V: Isolated_Bias (6 pins), Gate_Driver (R171.2)
VCC_HB_W: Isolated_Bias (6 pins), Gate_Driver (R173.2)
A+/H1: Connector (R115.2), Hall_Input (5 pins)
B+/H2: Connector (R116.2), Hall_Input (5 pins)
BEMF_U: Analog_Sense (C16.1 D14.2 R48.1 R51.2), Connector (R124.2)
BEMF_V: Analog_Sense (C17.1 D16.2 R49.1 R52.2), Connector (R126.2 R127.2)
BEMF_W: Analog_Sense (C18.1 D18.2 R50.1 R53.2), Connector (R128.2 R129.2 R131.2)
BKIN: Current Sense (11 pins), Connector (C97.1 R112.2 R113.2 R114.2)
CPOUT: Current Sense (C115.2 R166.1 U9.13), Connector (R119.2)
CS_RESET_U: Current Sense (SB4.2 SB5.2 TP40.1 U5.4), Connector (R180.2)
CS_RESET_V: Current Sense (SB6.2 SB7.2 TP48.1 U6.4), Connector (R181.2)
CS_RESET_W: Current Sense (SB8.2 SB9.2 TP56.1 U7.4), Connector (R182.2)
Curr_fdbk1: Current Sense (C106.1 R152.2 R161.1 TP39.1), Connector (R118.2)
Curr_fdbk2: Current Sense (5 pins), Connector (R120.2)
Curr_fdbk3: Current Sense (C108.1 R154.2 R165.1 TP55.1), Connector (R122.2)
CURRENT REF: Current Sense (R167.1), Connector (J7.1 R130.2 R132.2)
G_U_HO: Power_Section (R1.1 R2.1 R7.1 R8.1), Gate_Driver (TP15.1 U2.7)
G_U_HSig: Gate_Driver (R80.1 TP9.1), Connector (R105.2)
G_U_LO: Power_Section (R19.1 R20.1 R25.1 R26.1), Gate_Driver (TP16.1 U2.5)
G_U_LSig: Gate_Driver (R81.1 TP14.1), Connector (R106.2 R107.2)
G_V_HO: Power_Section (R3.1 R4.1 R9.1 R10.1), Gate_Driver (TP24.1 U3.7)
G_V_HSig: Gate_Driver (R85.1 TP18.1), Connector (R108.2)
G_V_LO: Power_Section (R21.1 R22.1 R27.1 R28.1), Gate_Driver (TP25.1 U3.5)
G_V_LSig: Gate_Driver (R86.1 TP23.1), Connector (R109.2)
G_W_HO: Power_Section (R5.1 R6.1 R11.1 R12.1), Gate_Driver (TP33.1 U4.7)
G_W_HSig: Gate_Driver (R90.1 TP27.1), Connector (R110.2)
G_W_LO: Power_Section (R23.1 R24.1 R29.1 R30.1), Gate_Driver (TP34.1 U4.5)
G_W_LSig: Gate_Driver (R91.1 TP32.1), Connector (R111.2)
GPIO_BEMF: Analog_Sense (6 pins), Connector (R121.2)
PH_U: Power_Section (7 pins), Gate_Driver (7 pins), Analog_Sense (R51.1)
PH_V: Power_Section (7 pins), Gate_Driver (7 pins), Analog_Sense (R52.1)
PH_W: Power_Section (7 pins), Gate_Driver (7 pins), Analog_Sense (R53.1)
Temperature Feedback: Connector (R125.2), Thermal_Sense (C105.2 R149.1 R150.1 R151.1)
V_Bus: Power_Section (C13.1 D13.2 R46.2 R47.2), Connector (R123.2)
V_Shunt_U_N: Power_Section (C1.2 R43.1), Current Sense (C88.2 TP36.1 U5.10)
V_Shunt_U_P: Power_Section (C1.1 R37.1), Current Sense (C88.1 TP35.1 U5.1)
V_Shunt_V_N: Power_Section (C2.2 R44.1), Current Sense (C91.2 TP44.1 U6.10)
V_Shunt_V_P: Power_Section (C2.1 R38.1), Current Sense (C91.1 TP43.1 U6.1)
V_Shunt_W_N: Power_Section (C3.2 R45.1), Current Sense (C94.2 TP52.1 U7.10)
V_Shunt_W_P: Power_Section (C3.1 R39.1), Current Sense (C94.1 TP51.1 U7.1)
Z+/H3: Connector (R117.2), Hall_Input (5 pins)

## Assembly variants
Variant of NUCLEOG431RB-Custom-IN-A2212: all parts fitted